# EAGLE design wi232_gnd (EAGLE 4.16)
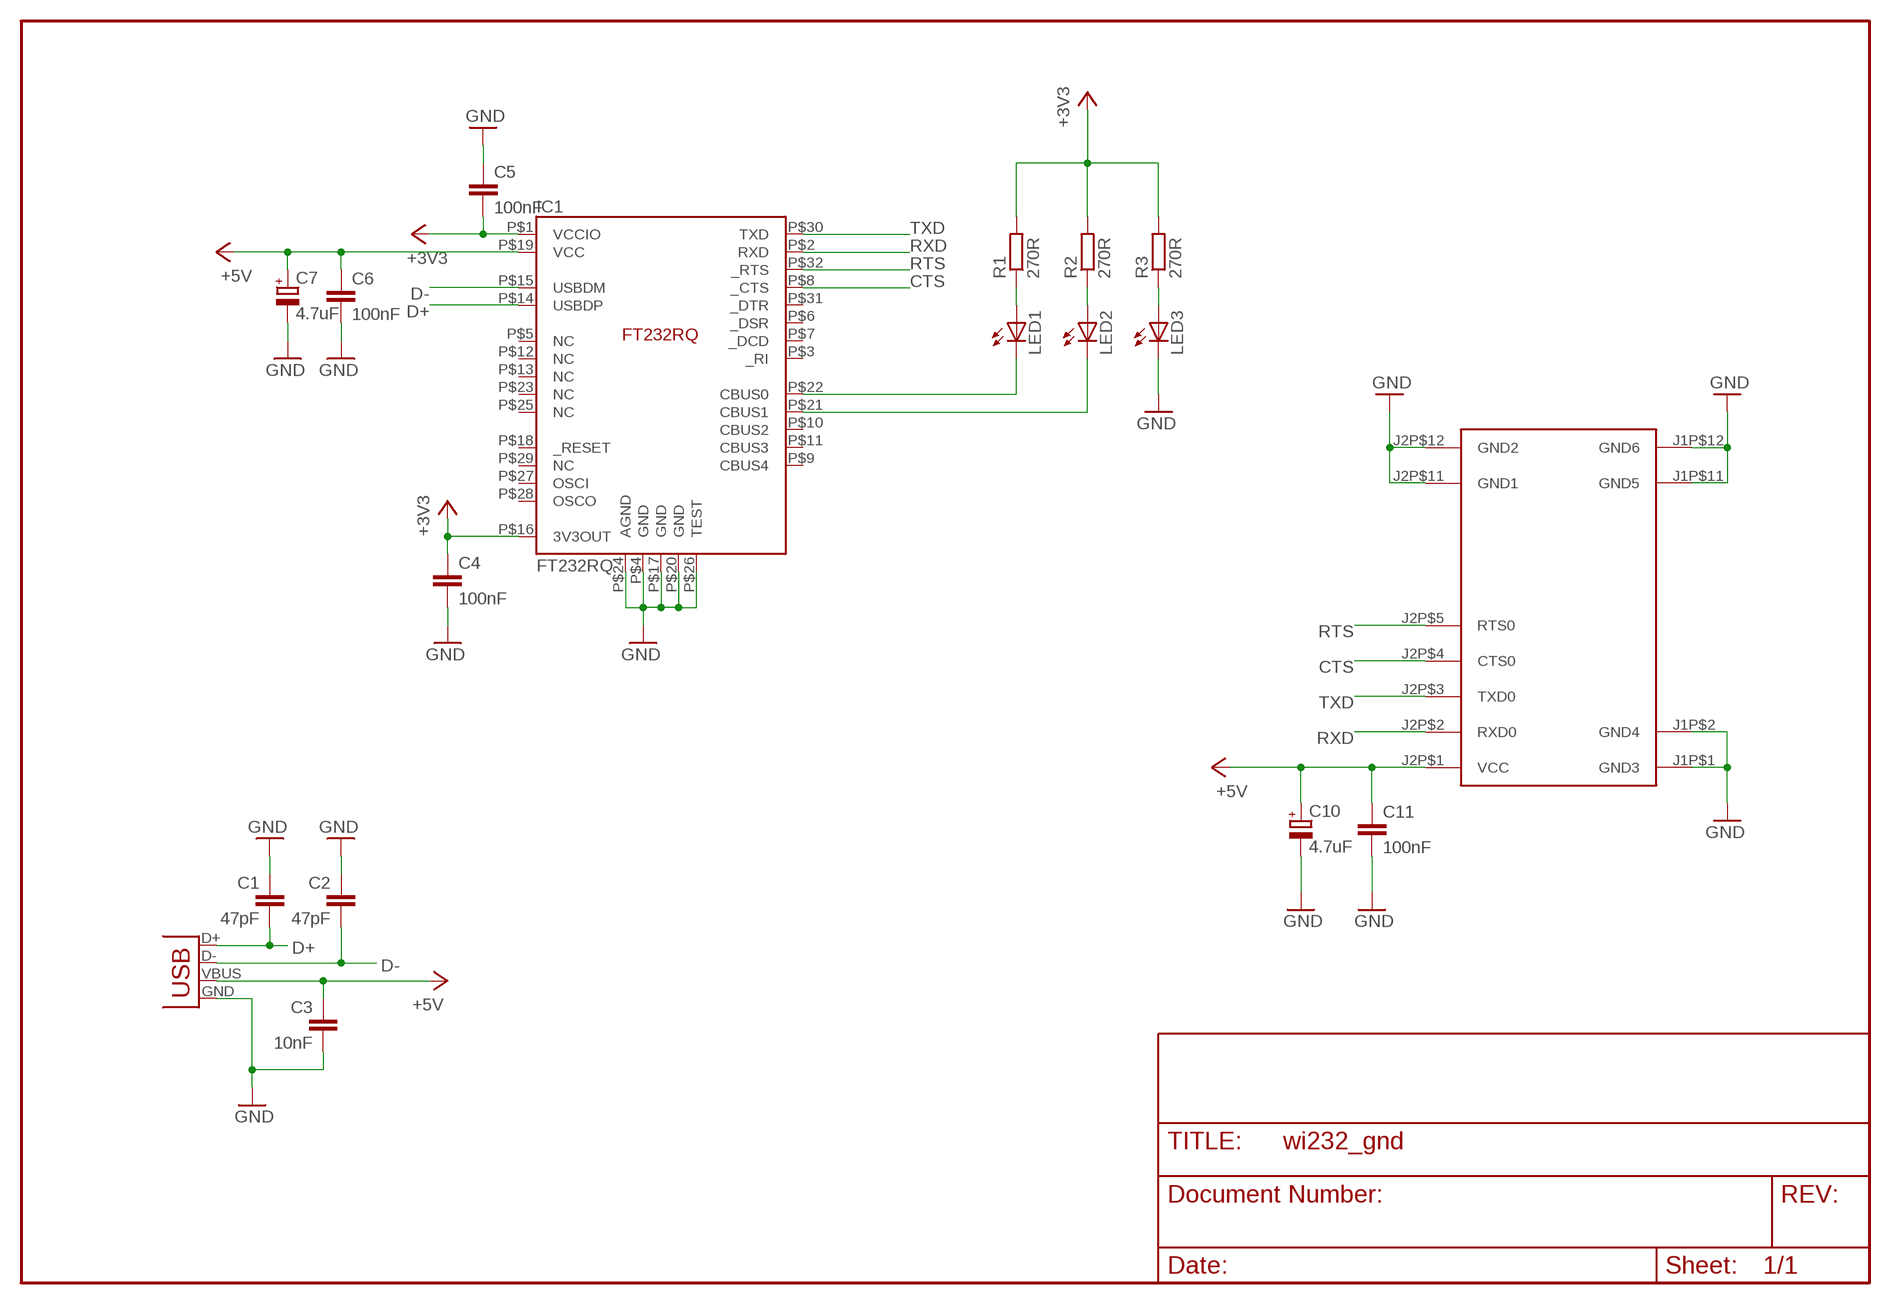
[diagram p0: schematic, sheet 1]

## Parts
C1  47pF  C-EUC0603K  [C0603K]
C2  47pF  C-EUC0603K  [C0603K]
C3  10nF  C-EUC0603K  [C0603K]
C4  100nF  C-EUC0603K  [C0603K]
C5  100nF  C-EUC0603K  [C0603K]
C6  100nF  C-EUC0603K  [C0603K]
C7  4.7uF  CPOL-EUSMCD  [SMC_D]
C10  4.7uF  CPOL-EUSMCD  [SMC_D]
C11  100nF  C-EUC0603K  [C0603K]
IC1  FT232RQ  [QFN-32]
LED1  LED3MM  [LED3MM]
LED2  LED3MM  [LED3MM]
LED3  LED3MM  [LED3MM]
R1  270R  R-EU_R0603  [R0603]
R2  270R  R-EU_R0603  [R0603]
R3  270R  R-EU_R0603  [R0603]
U$1  WI232_EV  [WI_232_EVM]
X1  USB-B-H  [USB-B-H]

## Nets
+3V3: C4.1 C5.2 IC1.P$1(VCCIO) IC1.P$16(3V3OUT) R1.2 R2.2 R3.2
+5V: C3.1 C6.1 C7.+ C10.+ C11.1 IC1.P$19(VCC) U$1.J2P$1(VCC) X1.VBUS
CTS: IC1.P$8(_CTS) U$1.J2P$4(CTS0)
D+: C1.2 IC1.P$14(USBDP) X1.D+
D-: C2.2 IC1.P$15(USBDM) X1.D-
GND: C1.1 C2.1 C3.2 C4.2 C5.1 C6.2 C7.- C10.- C11.2 IC1.P$4(GND) IC1.P$17(GND) IC1.P$20(GND) IC1.P$24(AGND) IC1.P$26(TEST) LED3.K(C) U$1.J1P$1(GND3) U$1.J1P$2(GND4) U$1.J1P$11(GND5) U$1.J1P$12(GND6) U$1.J2P$11(GND1) U$1.J2P$12(GND2) X1.GND
N$1: LED3.A R3.1
N$10: IC1.P$22(CBUS0) LED1.K(C)
N$11: LED1.A R1.1
N$12: IC1.P$21(CBUS1) LED2.K(C)
N$14: LED2.A R2.1
RTS: IC1.P$32(_RTS) U$1.J2P$5(RTS0)
RXD: IC1.P$2(RXD) U$1.J2P$2(RXD0)
TXD: IC1.P$30(TXD) U$1.J2P$3(TXD0)
Unconnected: IC1.P$3(_RI) IC1.P$5(NC) IC1.P$6(_DSR) IC1.P$7(_DCD) IC1.P$9(CBUS4) IC1.P$10(CBUS2) IC1.P$11(CBUS3) IC1.P$12(NC) IC1.P$13(NC) IC1.P$18(_RESET) IC1.P$23(NC) IC1.P$25(NC) IC1.P$27(OSCI) IC1.P$28(OSCO) IC1.P$29(NC) IC1.P$31(_DTR)

## Library data of the parts
C1-C6 C11 = rcl:C-EU: CAPACITOR, European symbol
C7 C10 = rcl:CPOL-EU: POLARIZED CAPACITOR, European symbol
IC1 = ftdi4:FT232RQ
LED1-LED3 = led:LED: LED OSRAM: - CHIPLED LG R971, LG N971, LY N971, LG Q971, LY Q971, LO R971, LY R971 LH N974, LH R974 LS Q976, LO Q976, LY Q976 LO Q996 - Hyper CHIPLED LW Q18S LB Q993, LB Q99A, LB R99A - SideLED LS A670, LO A670, LY A670, LG A670, LP A670 LB A673, LV A673, LT A673, LW A673 LH A674 LY A675 LS A676, LA A676, LO A676, LY A676, LW A676 LS A679, LY A679, LG A679 - Hyper Micro SIDELED® LS Y876, LA Y876, LO Y876, LY Y876 LT Y87S - SmartLED LW L88C, LW L88S LB L89C, LB L89S, LG L890 LS L89K, LO L89K, LY L89K LS L896, LA L896, LO L896, LY L896 - TOPLED LS T670, LO T670, LY T670, LG T670, LP T670 LSG T670, LSP T670, LSY T670, LOP T670, LYG T670 LG T671, LOG T671, LSG T671 LB T673, LV T673, LT T673, LW T673 LH T674 LS T676, LA T676, LO T676, LY T676, LB T676, LH T676, LSB T676, LW T676 LB T67C, LV T67C, LT T67C, LS T67K, LO T67K, LY T67K, LW E67C LS E67B, LA E67B, LO E67B, LY E67B, LB E67C, LV E67C, LT E67C LW T67C LS T679, LY T679, LG T679 LS T770, LO T770, LY T770, LG T770, LP T770 LB T773, LV T773, LT T773, LW T773 LH T774 LS E675, LA E675, LY E675, LS T675 LS T776, LA T776, LO T776, LY T776, LB T776 LHGB T686 LT T68C, LB T68C - Hyper Mini TOPLED® LB M676 - Mini TOPLED Santana® LG M470 LS M47K, LO M47K, LY M47K Source: http://www.osram.convergy.de/
R1-R3 = rcl:R-EU_: RESISTOR, European symbol
U$1 = paparazzi:WI232_EV
X1 = con-usb:USB: USB Connectors

## Board
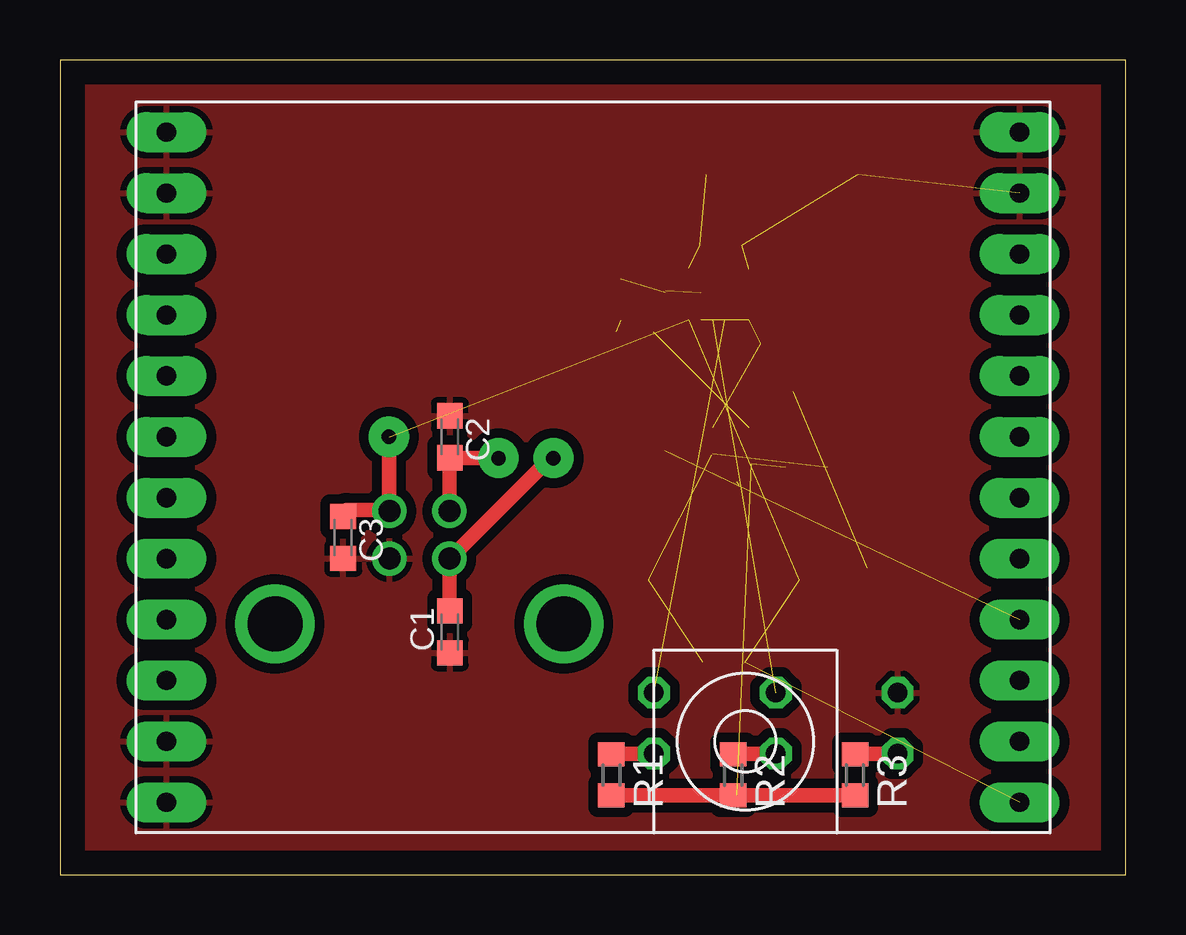
[diagram p1: board, top side]
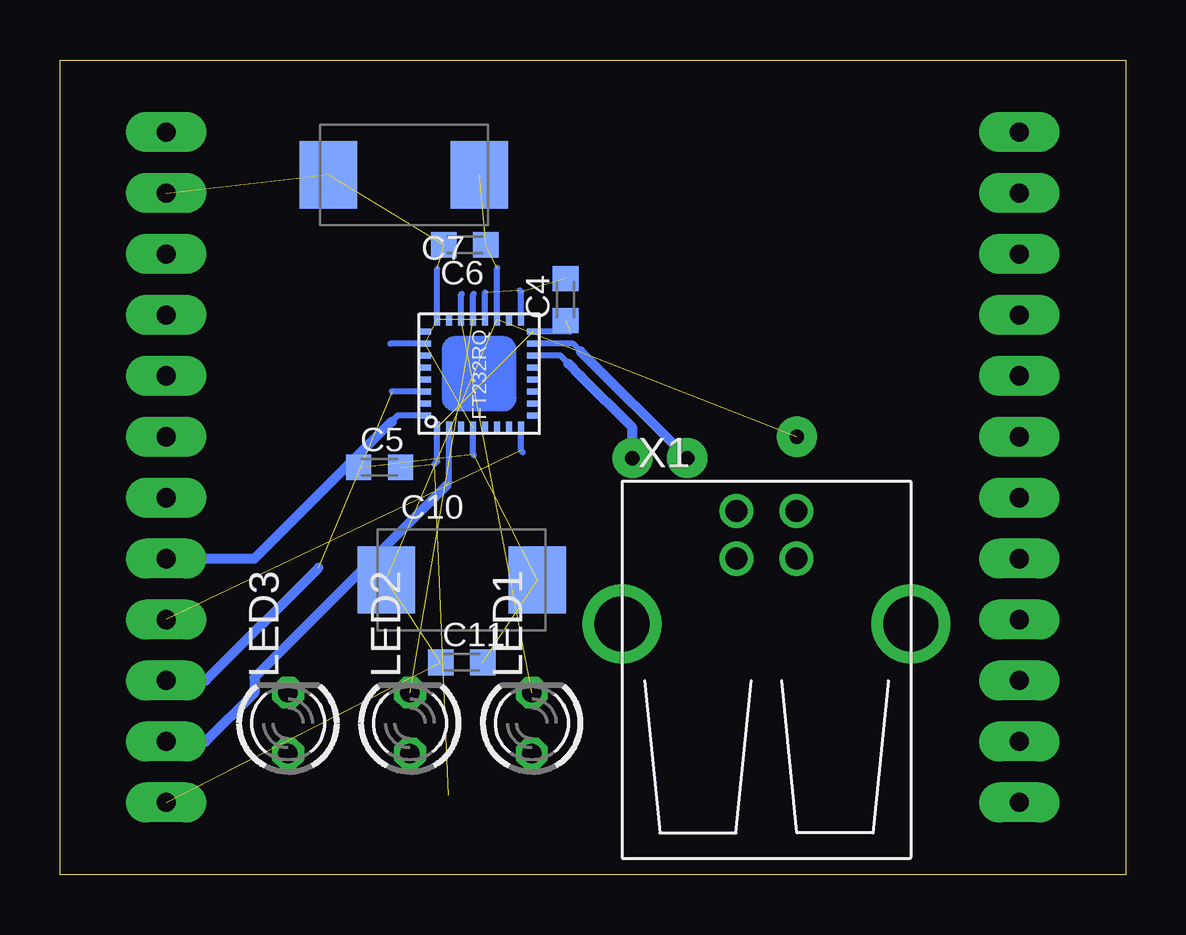
[diagram p2: board, bottom side, seen from below]

Size 44.43 x 33.96 mm. Coordinates in mm from the lower left corner, seen from the top.
Outline: 0,0 44.43,0 44.43,33.96 0,33.96 0,0
Copper layers (1*16): Top 0.035mm / dielectric 1.5mm / Bottom 0.035mm
Design rules "default": minimum track width 10mil, minimum drill 24mil, track to track 8mil, track to pad 8mil, pad to pad 8mil, via to via 8mil, smd to smd 8mil, copper to edge 40mil, drill to drill 8mil, minimum pad ring 10mil, minimum via ring 8mil, stop-mask expansion 4mil, vias tented up to drill 0mil, thermal gap 10mil

### Footprints (pad centres in the part's own frame; a part is rotated, then mirrored left to right if it is on the bottom)
C0603K = smd 1.05 x 1.08: 1 -0.875,0; 2 0.875,0
SMC_D = smd 2.4 x 2.8: + -3.15,0; - 3.15,0
QFN-32 = smd 0.5 x 0.25: P$1 0.25,-0.75; P$2 0.25,-1.25; P$3 0.25,-1.75; P$4 0.25,-2.25; P$5 0.25,-2.75; P$6 0.25,-3.25; P$7 0.25,-3.75; P$8 0.25,-4.25; P$17 4.75,-4.25; P$18 4.75,-3.75; P$19 4.75,-3.25; P$20 4.75,-2.75; P$21 4.75,-2.25; P$22 4.75,-1.75; P$23 4.75,-1.25; P$24 4.75,-0.75 | smd 0.25 x 0.5: P$9 0.75,-4.75; P$10 1.25,-4.75; P$11 1.75,-4.75; P$12 2.25,-4.75; P$13 2.75,-4.75; P$14 3.25,-4.75; P$15 3.75,-4.75; P$16 4.25,-4.75; P$25 4.25,-0.25; P$26 3.75,-0.25; P$27 3.25,-0.25; P$28 2.75,-0.25; P$29 2.25,-0.25; P$30 1.75,-0.25; P$31 1.25,-0.25; P$32 0.75,-0.25
LED3MM = drill 0.813 octagon: A -1.27,0; K 1.27,0
R0603 = smd 1 x 1.1: 1 -0.85,0; 2 0.85,0
WI_232_EVM = drill 0.8 pad 1.676 long: J1P$1 -17.78,0; J1P$2 -17.78,2.54; J1P$3 -17.78,5.08; J1P$4 -17.78,7.62; J1P$5 -17.78,10.16; J1P$6 -17.78,12.7; J1P$7 -17.78,15.24; J1P$8 -17.78,17.78; J1P$9 -17.78,20.32; J1P$10 -17.78,22.86; J1P$11 -17.78,25.4; J1P$12 -17.78,27.94; J2P$1 17.78,0; J2P$2 17.78,2.54; J2P$3 17.78,5.08; J2P$4 17.78,7.62; J2P$5 17.78,10.16; J2P$6 17.78,12.7; J2P$7 17.78,15.24; J2P$8 17.78,17.78; J2P$9 17.78,20.32; J2P$10 17.78,22.86; J2P$11 17.78,25.4; J2P$12 17.78,27.94
USB-B-H = drill 0.914 round: D+ 0,1.25; D- 1.981,1.25; GND 0,-1.25; VBUS 1.981,-1.25 | drill 2.286 round: P$1 -2.718,-6.02; P$2 -2.718,6.02

### Placement (x,y rotation side)
C1  16.25,10.12 90 top
C2  16.25,18.25 270 top
C3  11.81,14.06 270 top
C4  23.36,23.97 90 bottom
C5  31.11,16.98 0 bottom
C6  27.55,26.25 180 bottom
C7  30.09,29.17 180 bottom
C10  27.68,12.28 0 bottom
C11  27.68,8.85 0 bottom
IC1  29.46,18.38 90 bottom
LED1  24.76,6.31 90 bottom
LED2  29.84,6.31 90 bottom
LED3  34.92,6.31 90 bottom
R1  22.98,4.15 270 top
R2  28.06,4.15 270 top
R3  33.14,4.15 270 top
U$1  22.22,3.01 0 top
X1  14.98,13.17 90 bottom

### Tracks (layer width: path | path; a pad name or v marks a point on that pad's centre or on a via)
+3V3  (4 unrouted)
  Top 0.61: R1.2 28.02,3.3 28.06,3.26 R2.2 28.15,3.3 28.19,3.26 28.23,3.3 R3.2
  Bottom 0.254: IC1.P$1 28.71,17.22 28.82,17.11 | 23.18,22.63 IC1.P$16
+5V  (via drill 0.6 pad 1.68)  (6 unrouted)
  Top 0.61: 13.71,15.2 13.71,15.15 X1.VBUS 13.71,15.17 13.71,15.2 | 13.71,15.2 v13.71,18.25 | C3.1 11.95,15.2 13.71,15.2
  Bottom 0.254: IC1.P$19 26.21,25.29
CTS  (1 unrouted)
  Bottom 0.254: IC1.P$8 25.21,17.68 25.14,17.62
D+  (via drill 0.6 pad 1.68)
  Top 0.61: C1.2 16.25,10.88 16.23,10.9 X1.D+ 16.25,13.17 20.44,17.36 v20.57,17.36
  Bottom 0.254: IC1.P$14 23.57,21.63 23.24,21.3
  Bottom 0.406: v20.57,17.36 20.57,18.63 22.73,20.79 23.24,21.3
D-  (via drill 0.6 pad 1.68)
  Top 0.61: X1.D- 16.23,17.34 C2.2 18.27,17.38 v18.28,17.36
  Bottom 0.254: IC1.P$15 23.05,22.13 22.73,21.81
  Bottom 0.406: v18.28,17.36 22.73,21.81
GND  (11 unrouted)
  Bottom 0.254: IC1.P$24 28.71,25.25 | IC1.P$26 30.67,22.13 | IC1.P$20 26.71,24.26 | IC1.P$4 27.21,17.52 27.17,17.49 | IC1.P$17 25.21,24.29 25.27,24.35
  Bottom 0.61: C7.- 33.27,29.17
  pour Top (isolate 0.406): 0.5,33.49 43.81,33.49 43.81,0.47 0.38,0.47 0.38,33.49
N$1
  Top 0.61: R3.1 33.14,5.04 LED3.A
N$10  (1 unrouted)
  Bottom 0.254: IC1.P$22 27.71,24.19 27.68,24.22
N$11
  Top 0.61: R1.1 22.98,5.04 LED1.A
N$12  (1 unrouted)
  Bottom 0.254: IC1.P$21 27.21,24.18 27.17,24.22
N$14
  Top 0.61: R2.1 28.06,4.91 28.19,5.04 LED2.A
RTS
  Bottom 0.254: IC1.P$32 30.36,19.13 30.6,18.88
  Bottom 0.406: U$1.J2P$5 36.32,13.17 30.6,18.88
RXD  (1 unrouted)
  Bottom 0.254: 28.21,16.37 IC1.P$2
  Bottom 0.406: U$1.J2P$2 38.35,5.55 36.32,7.58 36.32,8.22 28.32,16.22
TXD  (1 unrouted)
  Bottom 0.254: IC1.P$30 30.57,20.13 30.6,20.16
  Bottom 0.406: U$1.J2P$3 38.35,8.09 33.65,12.79